# Altium schematic sheet IO.SchDoc
size A1
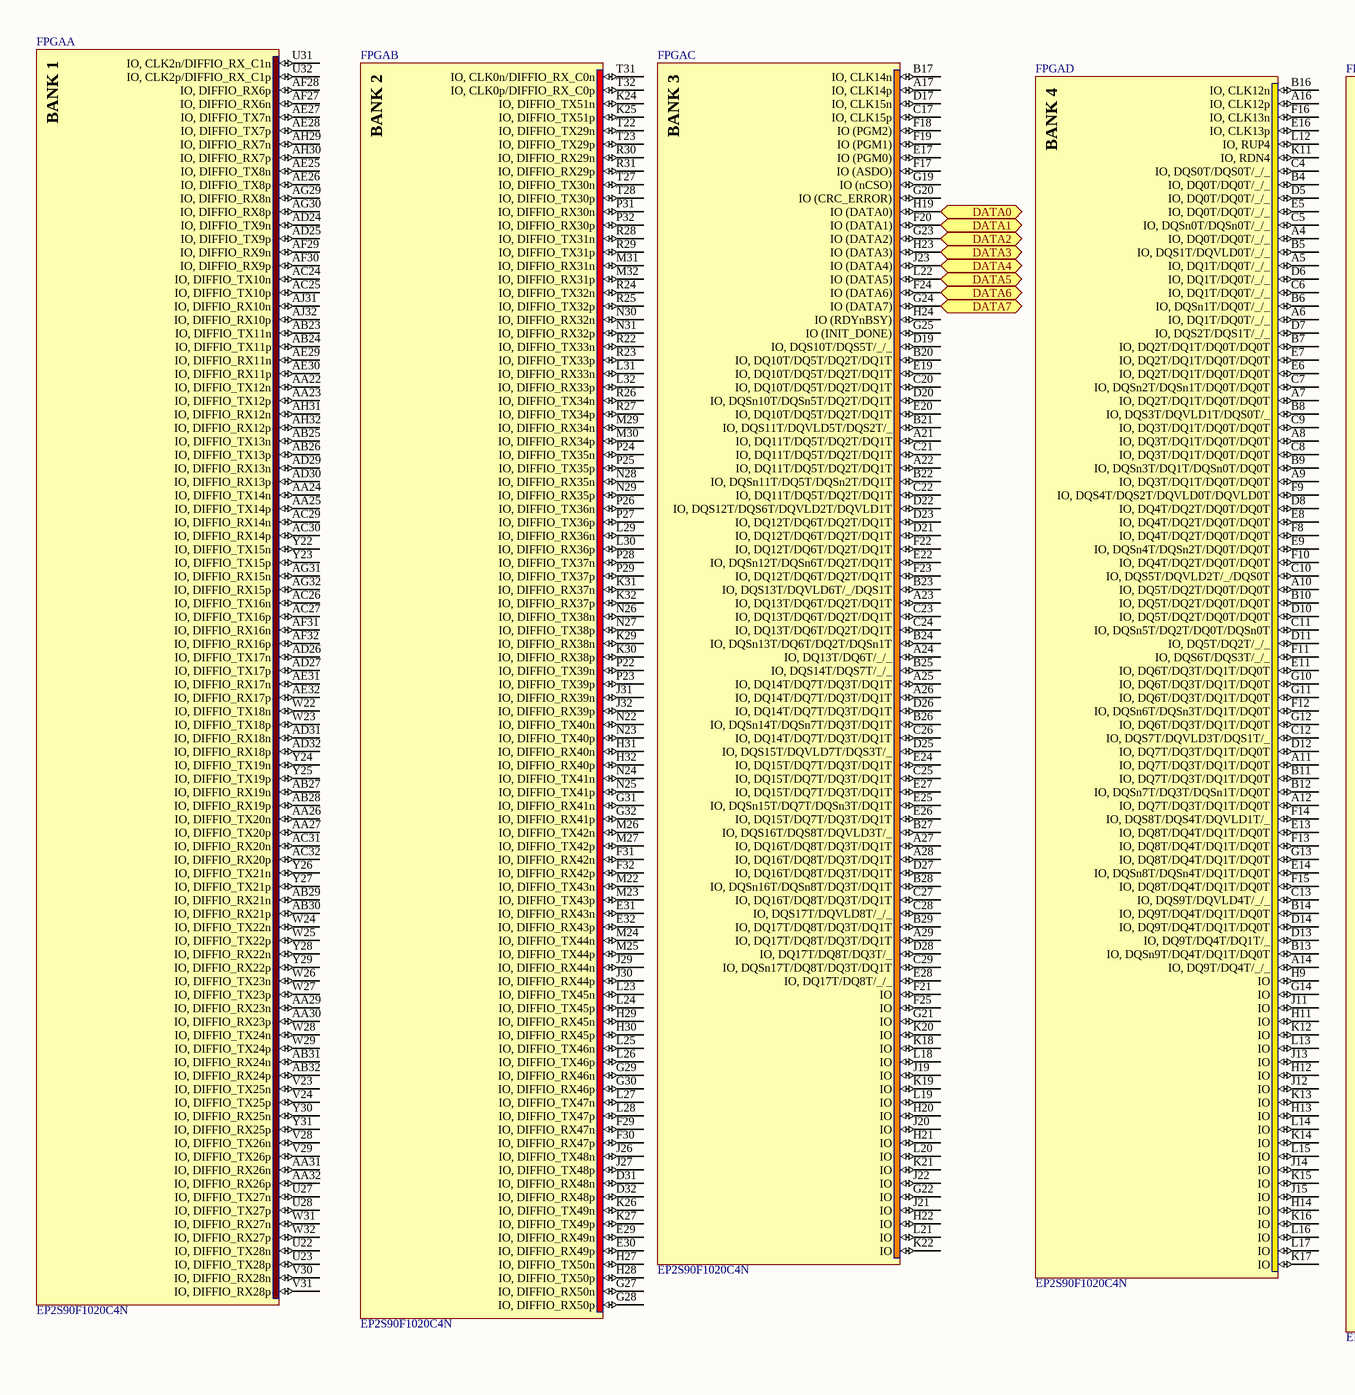
[diagram p0: IO.SchDoc, left]
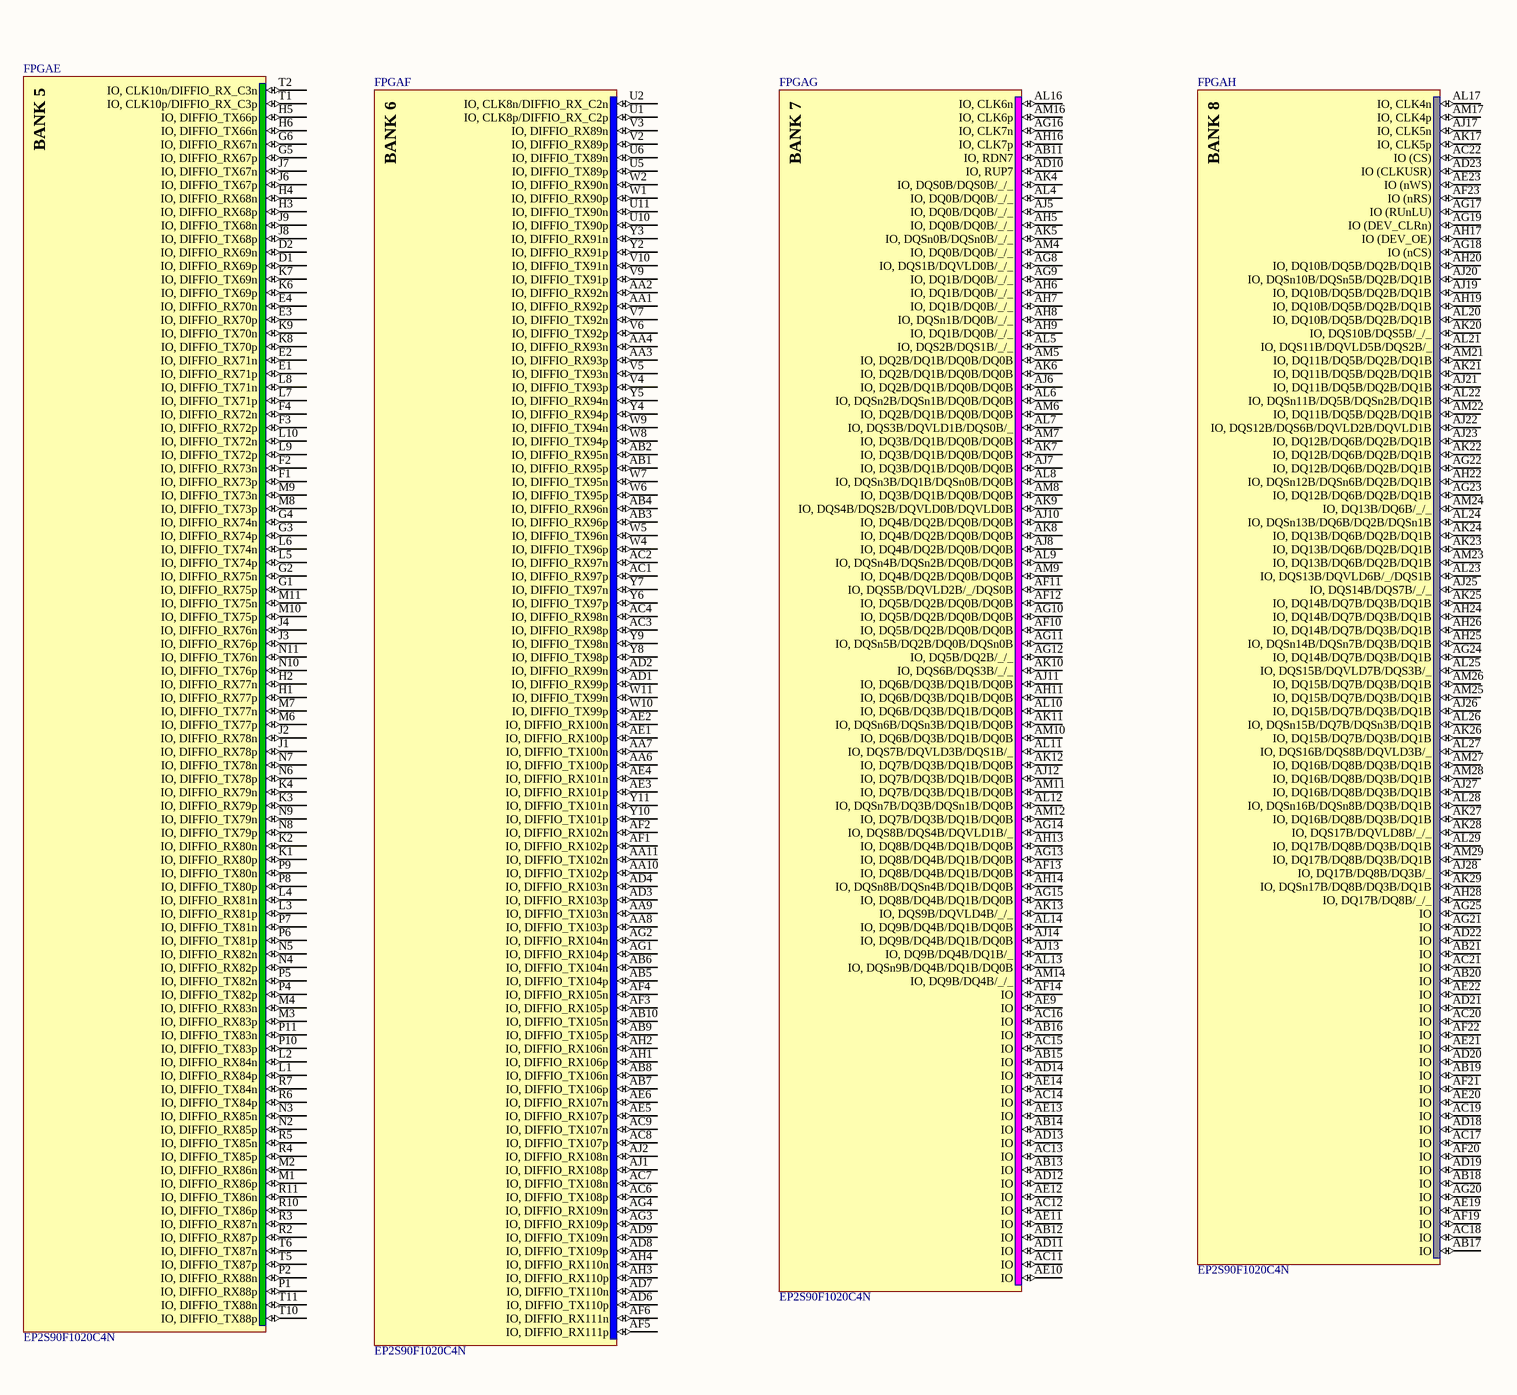
[diagram p1: IO.SchDoc, right]

## Parts
FPGA  EP2S90F1020C4N  [FBGA1020]  (parts A,B,C,D,E,F,G,H of 18)

## Ports
DATA0, DATA1, DATA2, DATA3, DATA4, DATA5, DATA6, DATA7

## Nets
DATA0: FPGA.H19(IO_(DATA0)) ; port DATA0
DATA1: FPGA.F20(IO_(DATA1)) ; port DATA1
DATA2: FPGA.G23(IO_(DATA2)) ; port DATA2
DATA3: FPGA.H23(IO_(DATA3)) ; port DATA3
DATA4: FPGA.J23(IO_(DATA4)) ; port DATA4
DATA5: FPGA.L22(IO_(DATA5)) ; port DATA5
DATA6: FPGA.F24(IO_(DATA6)) ; port DATA6
DATA7: FPGA.G24(IO_(DATA7)) ; port DATA7

Not connected (* = marked no-connect by the designer): FPGA A4(IO,_DQ0T/DQ0T/_/_) A5(IO,_DQ1T/DQ0T/_/_) A6(IO,_DQ1T/DQ0T/_/_) A7(IO,_DQ2T/DQ1T/DQ0T/DQ0T) A8(IO,_DQ3T/DQ1T/DQ0T/DQ0T) A9(IO,_DQ3T/DQ1T/DQ0T/DQ0T) A10(IO,_DQ5T/DQ2T/DQ0T/DQ0T) A11(IO,_DQ7T/DQ3T/DQ1T/DQ0T) A12(IO,_DQ7T/DQ3T/DQ1T/DQ0T) A14(IO,_DQ9T/DQ4T/_/_) A16(IO,_CLK12p) A17(IO,_CLK14p) A21(IO,_DQ11T/DQ5T/DQ2T/DQ1T) A22(IO,_DQ11T/DQ5T/DQ2T/DQ1T) A23(IO,_DQ13T/DQ6T/DQ2T/DQ1T) A24(IO,_DQ13T/DQ6T/_/_) A25(IO,_DQ14T/DQ7T/DQ3T/DQ1T) A26(IO,_DQ14T/DQ7T/DQ3T/DQ1T) A27(IO,_DQ16T/DQ8T/DQ3T/DQ1T) A28(IO,_DQ16T/DQ8T/DQ3T/DQ1T) A29(IO,_DQ17T/DQ8T/DQ3T/DQ1T) AA1(IO,_DIFFIO_RX92p) AA2(IO,_DIFFIO_RX92n) AA3(IO,_DIFFIO_RX93p) AA4(IO,_DIFFIO_RX93n) AA6(IO,_DIFFIO_TX100p) AA7(IO,_DIFFIO_TX100n) AA8(IO,_DIFFIO_TX103p) AA9(IO,_DIFFIO_TX103n) AA10(IO,_DIFFIO_TX102p) AA11(IO,_DIFFIO_TX102n) AA22(IO,_DIFFIO_TX12n) AA23(IO,_DIFFIO_TX12p) AA24(IO,_DIFFIO_TX14n) AA25(IO,_DIFFIO_TX14p) AA26(IO,_DIFFIO_TX20n) AA27(IO,_DIFFIO_TX20p) AA29(IO,_DIFFIO_RX23n) AA30(IO,_DIFFIO_RX23p) AA31(IO,_DIFFIO_RX26n) AA32(IO,_DIFFIO_RX26p) AB1(IO,_DIFFIO_RX95p) AB2(IO,_DIFFIO_RX95n) AB3(IO,_DIFFIO_RX96p) AB4(IO,_DIFFIO_RX96n) AB5(IO,_DIFFIO_TX104p) AB6(IO,_DIFFIO_TX104n) AB7(IO,_DIFFIO_TX106p) AB8(IO,_DIFFIO_TX106n) AB9(IO,_DIFFIO_TX105p) AB10(IO,_DIFFIO_TX105n) AB11(IO,_RDN7) AB12(IO) AB13(IO) AB14(IO) AB15(IO) AB16(IO) AB17(IO) AB18(IO) AB19(IO) AB20(IO) AB21(IO) AB23(IO,_DIFFIO_TX11n) AB24(IO,_DIFFIO_TX11p) AB25(IO,_DIFFIO_TX13n) AB26(IO,_DIFFIO_TX13p) AB27(IO,_DIFFIO_RX19n) AB28(IO,_DIFFIO_RX19p) AB29(IO,_DIFFIO_RX21n) AB30(IO,_DIFFIO_RX21p) AB31(IO,_DIFFIO_RX24n) AB32(IO,_DIFFIO_RX24p) AC1(IO,_DIFFIO_RX97p) AC2(IO,_DIFFIO_RX97n) AC3(IO,_DIFFIO_RX98p) AC4(IO,_DIFFIO_RX98n) AC6(IO,_DIFFIO_TX108p) AC7(IO,_DIFFIO_TX108n) AC8(IO,_DIFFIO_TX107p) AC9(IO,_DIFFIO_TX107n) AC11(IO) AC12(IO) AC13(IO) AC14(IO) AC15(IO) AC16(IO) AC17(IO) AC18(IO) AC19(IO) AC20(IO) AC21(IO) AC22(IO_(CS)) AC24(IO,_DIFFIO_TX10n) AC25(IO,_DIFFIO_TX10p) AC26(IO,_DIFFIO_TX16n) AC27(IO,_DIFFIO_TX16p) AC29(IO,_DIFFIO_RX14n) AC30(IO,_DIFFIO_RX14p) AC31(IO,_DIFFIO_RX20n) AC32(IO,_DIFFIO_RX20p) AD1(IO,_DIFFIO_RX99p) AD2(IO,_DIFFIO_RX99n) AD3(IO,_DIFFIO_RX103p) AD4(IO,_DIFFIO_RX103n) AD6(IO,_DIFFIO_TX110p) AD7(IO,_DIFFIO_TX110n) AD8(IO,_DIFFIO_TX109p) AD9(IO,_DIFFIO_TX109n) AD10(IO,_RUP7) AD11(IO) AD12(IO) AD13(IO) AD14(IO) AD18(IO) AD19(IO) AD20(IO) AD21(IO) AD22(IO) AD23(IO_(CLKUSR)) AD24(IO,_DIFFIO_TX9n) AD25(IO,_DIFFIO_TX9p) AD26(IO,_DIFFIO_TX17n) AD27(IO,_DIFFIO_TX17p) AD29(IO,_DIFFIO_RX13n) AD30(IO,_DIFFIO_RX13p) AD31(IO,_DIFFIO_RX18n) AD32(IO,_DIFFIO_RX18p) AE1(IO,_DIFFIO_RX100p) AE2(IO,_DIFFIO_RX100n) AE3(IO,_DIFFIO_RX101p) AE4(IO,_DIFFIO_RX101n) AE5(IO,_DIFFIO_RX107p) AE6(IO,_DIFFIO_RX107n) AE9(IO) AE10(IO) AE11(IO) AE12(IO) AE13(IO) AE14(IO) AE19(IO) AE20(IO) AE21(IO) AE22(IO) AE23(IO_(nWS)) AE25(IO,_DIFFIO_TX8n) AE26(IO,_DIFFIO_TX8p) AE27(IO,_DIFFIO_TX7n) AE28(IO,_DIFFIO_TX7p) AE29(IO,_DIFFIO_RX11n) AE30(IO,_DIFFIO_RX11p) AE31(IO,_DIFFIO_RX17n) AE32(IO,_DIFFIO_RX17p) AF1(IO,_DIFFIO_RX102p) AF2(IO,_DIFFIO_RX102n) AF3(IO,_DIFFIO_RX105p) AF4(IO,_DIFFIO_RX105n) AF5(IO,_DIFFIO_RX111p) AF6(IO,_DIFFIO_RX111n) AF10(IO,_DQ5B/DQ2B/DQ0B/DQ0B) AF11(IO,_DQS5B/DQVLD2B/_/DQS0B) AF12(IO,_DQ5B/DQ2B/DQ0B/DQ0B) AF13(IO,_DQ8B/DQ4B/DQ1B/DQ0B) AF14(IO) AF19(IO) AF20(IO) AF21(IO) AF22(IO) AF23(IO_(nRS)) AF27(IO,_DIFFIO_RX6n) AF28(IO,_DIFFIO_RX6p) AF29(IO,_DIFFIO_RX9n) AF30(IO,_DIFFIO_RX9p) AF31(IO,_DIFFIO_RX16n) AF32(IO,_DIFFIO_RX16p) AG1(IO,_DIFFIO_RX104p) AG2(IO,_DIFFIO_RX104n) AG3(IO,_DIFFIO_RX109p) AG4(IO,_DIFFIO_RX109n) AG8(IO,_DQS1B/DQVLD0B/_/_) AG9(IO,_DQ1B/DQ0B/_/_) AG10(IO,_DQ5B/DQ2B/DQ0B/DQ0B) AG11(IO,_DQSn5B/DQ2B/DQ0B/DQSn0B) AG12(IO,_DQ5B/DQ2B/_/_) AG13(IO,_DQ8B/DQ4B/DQ1B/DQ0B) AG14(IO,_DQS8B/DQS4B/DQVLD1B/_) AG15(IO,_DQ8B/DQ4B/DQ1B/DQ0B) AG16(IO,_CLK7n) AG17(IO_(RUnLU)) AG18(IO_(nCS)) AG19(IO_(DEV_CLRn)) AG20(IO) AG21(IO) AG22(IO,_DQ12B/DQ6B/DQ2B/DQ1B) AG23(IO,_DQ12B/DQ6B/DQ2B/DQ1B) AG24(IO,_DQ14B/DQ7B/DQ3B/DQ1B) AG25(IO) AG29(IO,_DIFFIO_RX8n) AG30(IO,_DIFFIO_RX8p) AG31(IO,_DIFFIO_RX15n) AG32(IO,_DIFFIO_RX15p) AH1(IO,_DIFFIO_RX106p) AH2(IO,_DIFFIO_RX106n) AH3(IO,_DIFFIO_RX110p) AH4(IO,_DIFFIO_RX110n) AH5(IO,_DQ0B/DQ0B/_/_) AH6(IO,_DQ1B/DQ0B/_/_) AH7(IO,_DQ1B/DQ0B/_/_) AH8(IO,_DQSn1B/DQ0B/_/_) AH9(IO,_DQ1B/DQ0B/_/_) AH11(IO,_DQ6B/DQ3B/DQ1B/DQ0B) AH13(IO,_DQ8B/DQ4B/DQ1B/DQ0B) AH14(IO,_DQSn8B/DQSn4B/DQ1B/DQ0B) AH16(IO,_CLK7p) AH17(IO_(DEV_OE)) AH19(IO,_DQ10B/DQ5B/DQ2B/DQ1B) AH20(IO,_DQ10B/DQ5B/DQ2B/DQ1B) AH22(IO,_DQSn12B/DQSn6B/DQ2B/DQ1B) AH24(IO,_DQ14B/DQ7B/DQ3B/DQ1B) AH25(IO,_DQSn14B/DQSn7B/DQ3B/DQ1B) AH26(IO,_DQ14B/DQ7B/DQ3B/DQ1B) AH28(IO,_DQ17B/DQ8B/_/_) AH29(IO,_DIFFIO_RX7n) AH30(IO,_DIFFIO_RX7p) AH31(IO,_DIFFIO_RX12n) AH32(IO,_DIFFIO_RX12p) AJ1(IO,_DIFFIO_RX108p) AJ2(IO,_DIFFIO_RX108n) AJ5(IO,_DQ0B/DQ0B/_/_) AJ6(IO,_DQ2B/DQ1B/DQ0B/DQ0B) AJ7(IO,_DQ3B/DQ1B/DQ0B/DQ0B) AJ8(IO,_DQ4B/DQ2B/DQ0B/DQ0B) AJ10(IO,_DQ4B/DQ2B/DQ0B/DQ0B) AJ11(IO,_DQ6B/DQ3B/DQ1B/DQ0B) AJ12(IO,_DQ7B/DQ3B/DQ1B/DQ0B) AJ13(IO,_DQ9B/DQ4B/DQ1B/_) AJ14(IO,_DQ9B/DQ4B/DQ1B/DQ0B) AJ17(IO,_CLK5n) AJ19(IO,_DQ10B/DQ5B/DQ2B/DQ1B) AJ20(IO,_DQSn10B/DQSn5B/DQ2B/DQ1B) AJ21(IO,_DQ11B/DQ5B/DQ2B/DQ1B) AJ22(IO,_DQS12B/DQS6B/DQVLD2B/DQVLD1B) AJ23(IO,_DQ12B/DQ6B/DQ2B/DQ1B) AJ25(IO,_DQS14B/DQS7B/_/_) AJ26(IO,_DQ15B/DQ7B/DQ3B/DQ1B) AJ27(IO,_DQ16B/DQ8B/DQ3B/DQ1B) AJ28(IO,_DQ17B/DQ8B/DQ3B/_) AJ31(IO,_DIFFIO_RX10n) AJ32(IO,_DIFFIO_RX10p) AK4(IO,_DQS0B/DQS0B/_/_) AK5(IO,_DQSn0B/DQSn0B/_/_) AK6(IO,_DQ2B/DQ1B/DQ0B/DQ0B) AK7(IO,_DQ3B/DQ1B/DQ0B/DQ0B) AK8(IO,_DQ4B/DQ2B/DQ0B/DQ0B) AK9(IO,_DQS4B/DQS2B/DQVLD0B/DQVLD0B) AK10(IO,_DQS6B/DQS3B/_/_) AK11(IO,_DQSn6B/DQSn3B/DQ1B/DQ0B) AK12(IO,_DQ7B/DQ3B/DQ1B/DQ0B) AK13(IO,_DQS9B/DQVLD4B/_/_) AK17(IO,_CLK5p) AK20(IO,_DQS10B/DQS5B/_/_) AK21(IO,_DQ11B/DQ5B/DQ2B/DQ1B) AK22(IO,_DQ12B/DQ6B/DQ2B/DQ1B) AK23(IO,_DQ13B/DQ6B/DQ2B/DQ1B) AK24(IO,_DQ13B/DQ6B/DQ2B/DQ1B) AK25(IO,_DQ14B/DQ7B/DQ3B/DQ1B) AK26(IO,_DQ15B/DQ7B/DQ3B/DQ1B) AK27(IO,_DQ16B/DQ8B/DQ3B/DQ1B) AK28(IO,_DQS17B/DQVLD8B/_/_) AK29(IO,_DQSn17B/DQ8B/DQ3B/DQ1B) AL4(IO,_DQ0B/DQ0B/_/_) AL5(IO,_DQS2B/DQS1B/_/_) AL6(IO,_DQSn2B/DQSn1B/DQ0B/DQ0B) AL7(IO,_DQS3B/DQVLD1B/DQS0B/_) AL8(IO,_DQSn3B/DQ1B/DQSn0B/DQ0B) AL9(IO,_DQSn4B/DQSn2B/DQ0B/DQ0B) AL10(IO,_DQ6B/DQ3B/DQ1B/DQ0B) AL11(IO,_DQS7B/DQVLD3B/DQS1B/_) AL12(IO,_DQSn7B/DQ3B/DQSn1B/DQ0B) AL13(IO,_DQSn9B/DQ4B/DQ1B/DQ0B) AL14(IO,_DQ9B/DQ4B/DQ1B/DQ0B) AL16(IO,_CLK6n) AL17(IO,_CLK4n) AL20(IO,_DQ10B/DQ5B/DQ2B/DQ1B) AL21(IO,_DQS11B/DQVLD5B/DQS2B/_) AL22(IO,_DQSn11B/DQ5B/DQSn2B/DQ1B) AL23(IO,_DQS13B/DQVLD6B/_/DQS1B) AL24(IO,_DQSn13B/DQ6B/DQ2B/DQSn1B) AL25(IO,_DQS15B/DQVLD7B/DQS3B/_) AL26(IO,_DQSn15B/DQ7B/DQSn3B/DQ1B) AL27(IO,_DQS16B/DQS8B/DQVLD3B/_) AL28(IO,_DQSn16B/DQSn8B/DQ3B/DQ1B) AL29(IO,_DQ17B/DQ8B/DQ3B/DQ1B) AM4(IO,_DQ0B/DQ0B/_/_) AM5(IO,_DQ2B/DQ1B/DQ0B/DQ0B) AM6(IO,_DQ2B/DQ1B/DQ0B/DQ0B) AM7(IO,_DQ3B/DQ1B/DQ0B/DQ0B) AM8(IO,_DQ3B/DQ1B/DQ0B/DQ0B) AM9(IO,_DQ4B/DQ2B/DQ0B/DQ0B) AM10(IO,_DQ6B/DQ3B/DQ1B/DQ0B) AM11(IO,_DQ7B/DQ3B/DQ1B/DQ0B) AM12(IO,_DQ7B/DQ3B/DQ1B/DQ0B) AM14(IO,_DQ9B/DQ4B/_/_) AM16(IO,_CLK6p) AM17(IO,_CLK4p) AM21(IO,_DQ11B/DQ5B/DQ2B/DQ1B) AM22(IO,_DQ11B/DQ5B/DQ2B/DQ1B) AM23(IO,_DQ13B/DQ6B/DQ2B/DQ1B) AM24(IO,_DQ13B/DQ6B/_/_) AM25(IO,_DQ15B/DQ7B/DQ3B/DQ1B) AM26(IO,_DQ15B/DQ7B/DQ3B/DQ1B) AM27(IO,_DQ16B/DQ8B/DQ3B/DQ1B) AM28(IO,_DQ16B/DQ8B/DQ3B/DQ1B) AM29(IO,_DQ17B/DQ8B/DQ3B/DQ1B) B4(IO,_DQ0T/DQ0T/_/_) B5(IO,_DQS1T/DQVLD0T/_/_) B6(IO,_DQSn1T/DQ0T/_/_) B7(IO,_DQ2T/DQ1T/DQ0T/DQ0T) B8(IO,_DQS3T/DQVLD1T/DQS0T/_) B9(IO,_DQSn3T/DQ1T/DQSn0T/DQ0T) B10(IO,_DQ5T/DQ2T/DQ0T/DQ0T) B11(IO,_DQ7T/DQ3T/DQ1T/DQ0T) B12(IO,_DQSn7T/DQ3T/DQSn1T/DQ0T) B13(IO,_DQSn9T/DQ4T/DQ1T/DQ0T) B14(IO,_DQ9T/DQ4T/DQ1T/DQ0T) B16(IO,_CLK12n) B17(IO,_CLK14n) B20(IO,_DQ10T/DQ5T/DQ2T/DQ1T) B21(IO,_DQS11T/DQVLD5T/DQS2T/_) B22(IO,_DQSn11T/DQ5T/DQSn2T/DQ1T) B23(IO,_DQS13T/DQVLD6T/_/DQS1T) B24(IO,_DQSn13T/DQ6T/DQ2T/DQSn1T) B25(IO,_DQS14T/DQS7T/_/_) B26(IO,_DQSn14T/DQSn7T/DQ3T/DQ1T) B27(IO,_DQS16T/DQS8T/DQVLD3T/_) B28(IO,_DQSn16T/DQSn8T/DQ3T/DQ1T) B29(IO,_DQ17T/DQ8T/DQ3T/DQ1T) C4(IO,_DQS0T/DQS0T/_/_) C5(IO,_DQSn0T/DQSn0T/_/_) C6(IO,_DQ1T/DQ0T/_/_) C7(IO,_DQSn2T/DQSn1T/DQ0T/DQ0T) C8(IO,_DQ3T/DQ1T/DQ0T/DQ0T) C9(IO,_DQ3T/DQ1T/DQ0T/DQ0T) C10(IO,_DQS5T/DQVLD2T/_/DQS0T) C11(IO,_DQSn5T/DQ2T/DQ0T/DQSn0T) C12(IO,_DQS7T/DQVLD3T/DQS1T/_) C13(IO,_DQS9T/DQVLD4T/_/_) C17(IO,_CLK15p) C20(IO,_DQ10T/DQ5T/DQ2T/DQ1T) C21(IO,_DQ11T/DQ5T/DQ2T/DQ1T) C22(IO,_DQ11T/DQ5T/DQ2T/DQ1T) C23(IO,_DQ13T/DQ6T/DQ2T/DQ1T) C24(IO,_DQ13T/DQ6T/DQ2T/DQ1T) C25(IO,_DQ15T/DQ7T/DQ3T/DQ1T) C26(IO,_DQ14T/DQ7T/DQ3T/DQ1T) C27(IO,_DQ16T/DQ8T/DQ3T/DQ1T) C28(IO,_DQS17T/DQVLD8T/_/_) C29(IO,_DQSn17T/DQ8T/DQ3T/DQ1T) D1(IO,_DIFFIO_RX69p) D2(IO,_DIFFIO_RX69n) D5(IO,_DQ0T/DQ0T/_/_) D6(IO,_DQ1T/DQ0T/_/_) D7(IO,_DQS2T/DQS1T/_/_) D8(IO,_DQ4T/DQ2T/DQ0T/DQ0T) D10(IO,_DQ5T/DQ2T/DQ0T/DQ0T) D11(IO,_DQ5T/DQ2T/_/_) D12(IO,_DQ7T/DQ3T/DQ1T/DQ0T) D13(IO,_DQ9T/DQ4T/DQ1T/_) D14(IO,_DQ9T/DQ4T/DQ1T/DQ0T) D17(IO,_CLK15n) D19(IO,_DQS10T/DQS5T/_/_) D20(IO,_DQSn10T/DQSn5T/DQ2T/DQ1T) D21(IO,_DQ12T/DQ6T/DQ2T/DQ1T) D22(IO,_DQS12T/DQS6T/DQVLD2T/DQVLD1T) D23(IO,_DQ12T/DQ6T/DQ2T/DQ1T) D25(IO,_DQS15T/DQVLD7T/DQS3T/_) D26(IO,_DQ14T/DQ7T/DQ3T/DQ1T) D27(IO,_DQ16T/DQ8T/DQ3T/DQ1T) D28(IO,_DQ17T/DQ8T/DQ3T/_) D31(IO,_DIFFIO_RX48n) D32(IO,_DIFFIO_RX48p) E1(IO,_DIFFIO_RX71p) E2(IO,_DIFFIO_RX71n) E3(IO,_DIFFIO_RX70p) E4(IO,_DIFFIO_RX70n) E5(IO,_DQ0T/DQ0T/_/_) E6(IO,_DQ2T/DQ1T/DQ0T/DQ0T) E7(IO,_DQ2T/DQ1T/DQ0T/DQ0T) E8(IO,_DQ4T/DQ2T/DQ0T/DQ0T) E9(IO,_DQSn4T/DQSn2T/DQ0T/DQ0T) E11(IO,_DQ6T/DQ3T/DQ1T/DQ0T) E13(IO,_DQ8T/DQ4T/DQ1T/DQ0T) E14(IO,_DQSn8T/DQSn4T/DQ1T/DQ0T) E16(IO,_CLK13p) E17(IO_(PGM0)) E19(IO,_DQ10T/DQ5T/DQ2T/DQ1T) E20(IO,_DQ10T/DQ5T/DQ2T/DQ1T) E22(IO,_DQSn12T/DQSn6T/DQ2T/DQ1T) E24(IO,_DQ15T/DQ7T/DQ3T/DQ1T) E25(IO,_DQSn15T/DQ7T/DQSn3T/DQ1T) E26(IO,_DQ15T/DQ7T/DQ3T/DQ1T) E27(IO,_DQ15T/DQ7T/DQ3T/DQ1T) E28(IO,_DQ17T/DQ8T/_/_) E29(IO,_DIFFIO_RX49n) E30(IO,_DIFFIO_RX49p) E31(IO,_DIFFIO_RX43n) E32(IO,_DIFFIO_RX43p) F1(IO,_DIFFIO_RX73p) F2(IO,_DIFFIO_RX73n) F3(IO,_DIFFIO_RX72p) F4(IO,_DIFFIO_RX72n) F8(IO,_DQ4T/DQ2T/DQ0T/DQ0T) F9(IO,_DQS4T/DQS2T/DQVLD0T/DQVLD0T) F10(IO,_DQ4T/DQ2T/DQ0T/DQ0T) F11(IO,_DQS6T/DQS3T/_/_) F12(IO,_DQSn6T/DQSn3T/DQ1T/DQ0T) F13(IO,_DQ8T/DQ4T/DQ1T/DQ0T) F14(IO,_DQS8T/DQS4T/DQVLD1T/_) F15(IO,_DQ8T/DQ4T/DQ1T/DQ0T) F16(IO,_CLK13n) F17(IO_(ASDO)) F18(IO_(PGM2)) F19(IO_(PGM1)) F21(IO) F22(IO,_DQ12T/DQ6T/DQ2T/DQ1T) F23(IO,_DQ12T/DQ6T/DQ2T/DQ1T) F25(IO) F29(IO,_DIFFIO_RX47n) F30(IO,_DIFFIO_RX47p) F31(IO,_DIFFIO_RX42n) F32(IO,_DIFFIO_RX42p) G1(IO,_DIFFIO_RX75p) G2(IO,_DIFFIO_RX75n) G3(IO,_DIFFIO_RX74p) G4(IO,_DIFFIO_RX74n) G5(IO,_DIFFIO_RX67p) G6(IO,_DIFFIO_RX67n) G10(IO,_DQ6T/DQ3T/DQ1T/DQ0T) G11(IO,_DQ6T/DQ3T/DQ1T/DQ0T) G12(IO,_DQ6T/DQ3T/DQ1T/DQ0T) G13(IO,_DQ8T/DQ4T/DQ1T/DQ0T) G14(IO) G19(IO_(nCSO)) G20(IO_(CRC_ERROR)) G21(IO) G22(IO) G25(IO_(INIT_DONE)) G27(IO,_DIFFIO_RX50n) G28(IO,_DIFFIO_RX50p) G29(IO,_DIFFIO_RX46n) G30(IO,_DIFFIO_RX46p) G31(IO,_DIFFIO_RX41n) G32(IO,_DIFFIO_RX41p) H1(IO,_DIFFIO_RX77p) H2(IO,_DIFFIO_RX77n) H3(IO,_DIFFIO_RX68p) H4(IO,_DIFFIO_RX68n) H5(IO,_DIFFIO_TX66p) H6(IO,_DIFFIO_TX66n) H9(IO) H11(IO) H12(IO) H13(IO) H14(IO) H20(IO) H21(IO) H22(IO) H24(IO_(RDYnBSY)) H27(IO,_DIFFIO_TX50n) H28(IO,_DIFFIO_TX50p) H29(IO,_DIFFIO_RX45n) H30(IO,_DIFFIO_RX45p) H31(IO,_DIFFIO_RX40n) H32(IO,_DIFFIO_RX40p) J1(IO,_DIFFIO_RX78p) J2(IO,_DIFFIO_RX78n) J3(IO,_DIFFIO_RX76p) J4(IO,_DIFFIO_RX76n) J6(IO,_DIFFIO_TX67p) J7(IO,_DIFFIO_TX67n) J8(IO,_DIFFIO_TX68p) J9(IO,_DIFFIO_TX68n) J11(IO) J12(IO) J13(IO) J14(IO) J15(IO) J19(IO) J20(IO) J21(IO) J22(IO) J26(IO,_DIFFIO_TX48n) J27(IO,_DIFFIO_TX48p) J29(IO,_DIFFIO_RX44n) J30(IO,_DIFFIO_RX44p) J31(IO,_DIFFIO_RX39n) J32(IO,_DIFFIO_RX39p) K1(IO,_DIFFIO_RX80p) K2(IO,_DIFFIO_RX80n) K3(IO,_DIFFIO_RX79p) K4(IO,_DIFFIO_RX79n) K6(IO,_DIFFIO_TX69p) K7(IO,_DIFFIO_TX69n) K8(IO,_DIFFIO_TX70p) K9(IO,_DIFFIO_TX70n) K11(IO,_RDN4) K12(IO) K13(IO) K14(IO) K15(IO) K16(IO) K17(IO) K18(IO) K19(IO) K20(IO) K21(IO) K22(IO) K24(IO,_DIFFIO_TX51n) K25(IO,_DIFFIO_TX51p) K26(IO,_DIFFIO_TX49n) K27(IO,_DIFFIO_TX49p) K29(IO,_DIFFIO_RX38n) K30(IO,_DIFFIO_RX38p) K31(IO,_DIFFIO_RX37n) K32(IO,_DIFFIO_RX37p) L1(IO,_DIFFIO_RX84p) L2(IO,_DIFFIO_RX84n) L3(IO,_DIFFIO_RX81p) L4(IO,_DIFFIO_RX81n) L5(IO,_DIFFIO_TX74p) L6(IO,_DIFFIO_TX74n) L7(IO,_DIFFIO_TX71p) L8(IO,_DIFFIO_TX71n) L9(IO,_DIFFIO_TX72p) L10(IO,_DIFFIO_TX72n) L12(IO,_RUP4) L13(IO) L14(IO) L15(IO) L16(IO) L17(IO) L18(IO) L19(IO) L20(IO) L21(IO) L23(IO,_DIFFIO_TX45n) L24(IO,_DIFFIO_TX45p) L25(IO,_DIFFIO_TX46n) L26(IO,_DIFFIO_TX46p) L27(IO,_DIFFIO_TX47n) L28(IO,_DIFFIO_TX47p) L29(IO,_DIFFIO_RX36n) L30(IO,_DIFFIO_RX36p) L31(IO,_DIFFIO_RX33n) L32(IO,_DIFFIO_RX33p) M1(IO,_DIFFIO_RX86p) M2(IO,_DIFFIO_RX86n) M3(IO,_DIFFIO_RX83p) M4(IO,_DIFFIO_RX83n) M6(IO,_DIFFIO_TX77p) M7(IO,_DIFFIO_TX77n) M8(IO,_DIFFIO_TX73p) M9(IO,_DIFFIO_TX73n) M10(IO,_DIFFIO_TX75p) M11(IO,_DIFFIO_TX75n) M22(IO,_DIFFIO_TX43n) M23(IO,_DIFFIO_TX43p) M24(IO,_DIFFIO_TX44n) M25(IO,_DIFFIO_TX44p) M26(IO,_DIFFIO_TX42n) M27(IO,_DIFFIO_TX42p) M29(IO,_DIFFIO_RX34n) M30(IO,_DIFFIO_RX34p) M31(IO,_DIFFIO_RX31n) M32(IO,_DIFFIO_RX31p) N2(IO,_DIFFIO_RX85p) N3(IO,_DIFFIO_RX85n) N4(IO,_DIFFIO_RX82p) N5(IO,_DIFFIO_RX82n) N6(IO,_DIFFIO_TX78p) N7(IO,_DIFFIO_TX78n) N8(IO,_DIFFIO_TX79p) N9(IO,_DIFFIO_TX79n) N10(IO,_DIFFIO_TX76p) N11(IO,_DIFFIO_TX76n) N22(IO,_DIFFIO_TX40n) N23(IO,_DIFFIO_TX40p) N24(IO,_DIFFIO_TX41n) N25(IO,_DIFFIO_TX41p) N26(IO,_DIFFIO_TX38n) N27(IO,_DIFFIO_TX38p) N28(IO,_DIFFIO_RX35n) N29(IO,_DIFFIO_RX35p) N30(IO,_DIFFIO_RX32n) N31(IO,_DIFFIO_RX32p) P1(IO,_DIFFIO_RX88p) P2(IO,_DIFFIO_RX88n) P4(IO,_DIFFIO_TX82p) P5(IO,_DIFFIO_TX82n) P6(IO,_DIFFIO_TX81p) P7(IO,_DIFFIO_TX81n) P8(IO,_DIFFIO_TX80p) P9(IO,_DIFFIO_TX80n) P10(IO,_DIFFIO_TX83p) P11(IO,_DIFFIO_TX83n) P22(IO,_DIFFIO_TX39n) P23(IO,_DIFFIO_TX39p) P24(IO,_DIFFIO_TX35n) P25(IO,_DIFFIO_TX35p) P26(IO,_DIFFIO_TX36n) P27(IO,_DIFFIO_TX36p) P28(IO,_DIFFIO_TX37n) P29(IO,_DIFFIO_TX37p) P31(IO,_DIFFIO_RX30n) P32(IO,_DIFFIO_RX30p) R2(IO,_DIFFIO_RX87p) R3(IO,_DIFFIO_RX87n) R4(IO,_DIFFIO_TX85p) R5(IO,_DIFFIO_TX85n) R6(IO,_DIFFIO_TX84p) R7(IO,_DIFFIO_TX84n) R10(IO,_DIFFIO_TX86p) R11(IO,_DIFFIO_TX86n) R22(IO,_DIFFIO_TX33n) R23(IO,_DIFFIO_TX33p) R24(IO,_DIFFIO_TX32n) R25(IO,_DIFFIO_TX32p) R26(IO,_DIFFIO_TX34n) R27(IO,_DIFFIO_TX34p) R28(IO,_DIFFIO_TX31n) R29(IO,_DIFFIO_TX31p) R30(IO,_DIFFIO_RX29n) R31(IO,_DIFFIO_RX29p) T1(IO,_CLK10p/DIFFIO_RX_C3p) T2(IO,_CLK10n/DIFFIO_RX_C3n) T5(IO,_DIFFIO_TX87p) T6(IO,_DIFFIO_TX87n) T10(IO,_DIFFIO_TX88p) T11(IO,_DIFFIO_TX88n) T22(IO,_DIFFIO_TX29n) T23(IO,_DIFFIO_TX29p) T27(IO,_DIFFIO_TX30n) T28(IO,_DIFFIO_TX30p) T31(IO,_CLK0n/DIFFIO_RX_C0n) T32(IO,_CLK0p/DIFFIO_RX_C0p) U1(IO,_CLK8p/DIFFIO_RX_C2p) U2(IO,_CLK8n/DIFFIO_RX_C2n) U5(IO,_DIFFIO_TX89p) U6(IO,_DIFFIO_TX89n) U10(IO,_DIFFIO_TX90p) U11(IO,_DIFFIO_TX90n) U22(IO,_DIFFIO_TX28n) U23(IO,_DIFFIO_TX28p) U27(IO,_DIFFIO_TX27n) U28(IO,_DIFFIO_TX27p) U31(IO,_CLK2n/DIFFIO_RX_C1n) U32(IO,_CLK2p/DIFFIO_RX_C1p) V2(IO,_DIFFIO_RX89p) V3(IO,_DIFFIO_RX89n) V4(IO,_DIFFIO_TX93p) V5(IO,_DIFFIO_TX93n) V6(IO,_DIFFIO_TX92p) V7(IO,_DIFFIO_TX92n) V9(IO,_DIFFIO_TX91p) V10(IO,_DIFFIO_TX91n) V23(IO,_DIFFIO_TX25n) V24(IO,_DIFFIO_TX25p) V28(IO,_DIFFIO_TX26n) V29(IO,_DIFFIO_TX26p) V30(IO,_DIFFIO_RX28n) V31(IO,_DIFFIO_RX28p) W1(IO,_DIFFIO_RX90p) W2(IO,_DIFFIO_RX90n) W4(IO,_DIFFIO_TX96p) W5(IO,_DIFFIO_TX96n) W6(IO,_DIFFIO_TX95p) W7(IO,_DIFFIO_TX95n) W8(IO,_DIFFIO_TX94p) W9(IO,_DIFFIO_TX94n) W10(IO,_DIFFIO_TX99p) W11(IO,_DIFFIO_TX99n) W22(IO,_DIFFIO_TX18n) W23(IO,_DIFFIO_TX18p) W24(IO,_DIFFIO_TX22n) W25(IO,_DIFFIO_TX22p) W26(IO,_DIFFIO_TX23n) W27(IO,_DIFFIO_TX23p) W28(IO,_DIFFIO_TX24n) W29(IO,_DIFFIO_TX24p) W31(IO,_DIFFIO_RX27n) W32(IO,_DIFFIO_RX27p) Y2(IO,_DIFFIO_RX91p) Y3(IO,_DIFFIO_RX91n) Y4(IO,_DIFFIO_RX94p) Y5(IO,_DIFFIO_RX94n) Y6(IO,_DIFFIO_TX97p) Y7(IO,_DIFFIO_TX97n) Y8(IO,_DIFFIO_TX98p) Y9(IO,_DIFFIO_TX98n) Y10(IO,_DIFFIO_TX101p) Y11(IO,_DIFFIO_TX101n) Y22(IO,_DIFFIO_TX15n) Y23(IO,_DIFFIO_TX15p) Y24(IO,_DIFFIO_TX19n) Y25(IO,_DIFFIO_TX19p) Y26(IO,_DIFFIO_TX21n) Y27(IO,_DIFFIO_TX21p) Y28(IO,_DIFFIO_RX22n) Y29(IO,_DIFFIO_RX22p) Y30(IO,_DIFFIO_RX25n) Y31(IO,_DIFFIO_RX25p)

## Notes on the sheet
- (in symbol EP2S90F1020C4N, part A) BANK 1
- (in symbol EP2S90F1020C4N, part B) BANK 2
- (in symbol EP2S90F1020C4N, part C) BANK 3
- (in symbol EP2S90F1020C4N, part D) BANK 4
- (in symbol EP2S90F1020C4N, part E) BANK 5
- (in symbol EP2S90F1020C4N, part F) BANK 6
- (in symbol EP2S90F1020C4N, part G) BANK 7
- (in symbol EP2S90F1020C4N, part H) BANK 8

## Library data of the parts
FPGA = EP2S90F1020C4N: Stratix II 1.2V FPGA, 758 I/Os, 1020-Pin FineLine BGA, Speed Grade 4, Commercial Grade, Pb-Free; Note: DQS signal pins in banks 3, 4, 7 & 8 named according to DQ bus modes. "/" separates each mode. ie. Mode x4, x8/x9, x16/x18 and x32/x36.; Published: 8-Jul-2005; LatestRevisionDate: 13-Apr-2006; LatestRevisionNote: IPC-7351 Footprint Added.; DatasheetVersion: ver4.3, Jan-2008; PackageVersion: ver15.1, May-2008; PackageReference: FBGA1020; Publisher: Altium Limited; PackageDescription: 1020-Ball FineLine Ball Grid Array (FBGA1020) - Flip Chip; Code_JEDEC: MS-034-AAP-1; ComponentLink1Description: Manufacturer Link; ComponentLink1URL: http://www.altera.com/products/devices/stratix2/st2-index.jsp; ComponentLink2Description: Handbook; ComponentLink2URL: http://www.altera.com/literature/hb/stx2/stratix2_handbook.pdf; ComponentLink3Description: Packaging Specification; ComponentLink3URL: http://www.altera.com/literature/ds/dspkg.pdf